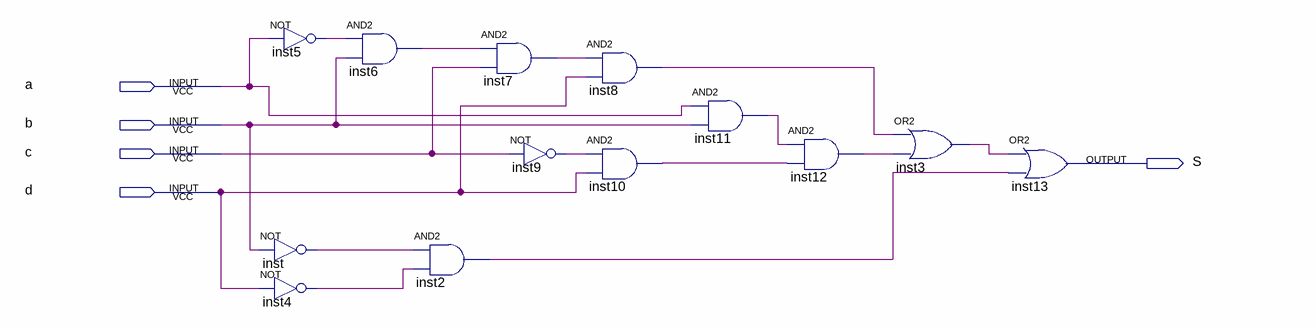
[diagram p0: schematic sheet]
// Quartus schematic misc_2.bdf as structural Verilog: 13 symbols, 5 pins
module misc_2 (
  input  a,
  input  b,
  input  c,
  input  d,
  output S
);

  wire inst2_out, inst3_out, inst4_out, inst5_out, inst6_out, inst7_out, inst8_out, inst9_out, inst10_out,
       inst11_out, inst12_out, inst_out;

  not inst5 (inst5_out, a);
  not inst (inst_out, b);
  not inst4 (inst4_out, d);
  and inst6 (inst6_out, inst5_out, b);
  and inst2 (inst2_out, inst_out, inst4_out);
  and inst7 (inst7_out, inst6_out, c);
  not inst9 (inst9_out, c);
  and inst8 (inst8_out, inst7_out, d);
  and inst10 (inst10_out, inst9_out, d);
  and inst11 (inst11_out, a, b);
  and inst12 (inst12_out, inst11_out, inst10_out);
  or inst3 (inst3_out, inst8_out, inst12_out);
  or inst13 (S, inst3_out, inst2_out);
endmodule
